# EAGLE schematic ComClone2 (EAGLE 6.3)
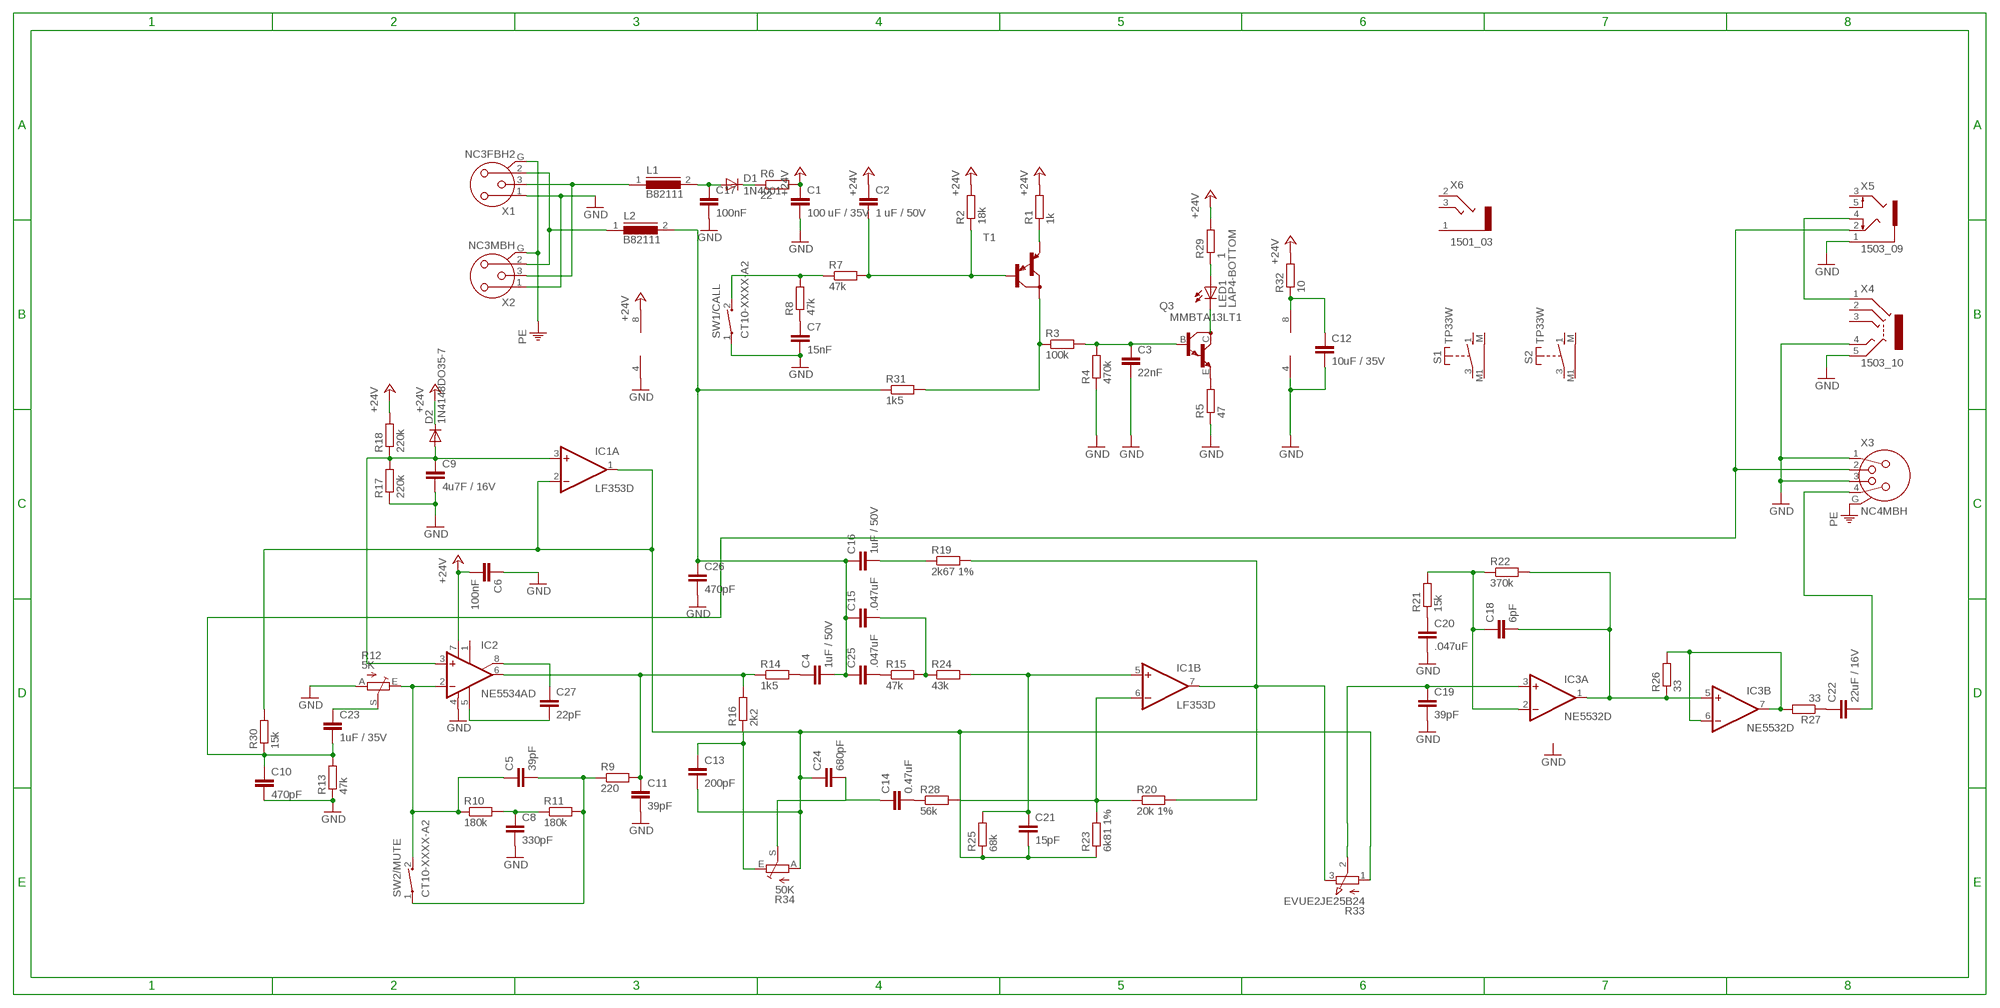
[diagram p0: schematic, sheet 1]

## Parts
C1  100 uF / 35V  C-EUC1206  [C1206]
C2  1 uF / 50V  C-EUC1206  [C1206]
C3  22nF  C-EUC0603  [C0603]
C4  1uF / 50V  C-EUC1206  [C1206]
C5  39pF  C-EUC0603  [C0603]
C6  100nF  C-EUC1206  [C1206]
C7  15nF  C-EUC0603  [C0603]
C8  330pF  C-EUC0603  [C0603]
C9  4u7F / 16V  C-EUC1206  [C1206]
C10  470pF  C-EUC0603  [C0603]
C11  39pF  C-EUC0603  [C0603]
C12  10uF / 35V  C-EUC1206  [C1206]
C13  200pF  C-EUC0603  [C0603]
C14  0.47uF  C-EUC0603  [C0603]
C15  .047uF  C-EUC1206  [C1206]
C16  1uF / 50V  C-EUC3225  [C3225]
C17  100nF  C-EUC1206  [C1206]
C18  6pF  C-EUC1206  [C1206]
C19  39pF  C-EUC1206  [C1206]
C20  .047uF  C-EUC1206  [C1206]
C21  15pF  C-EUC1206  [C1206]
C22  22uF / 16V  C-EUC1206  [C1206]
C23  1uF / 35V  C-EUC1206  [C1206]
C24  680pF  C-EUC0603  [C0603]
C25  .047uF  C-EUC0603  [C0603]
C26  470pF  C-EUC0603  [C0603]
C27  22pF  C-EUC0603  [C0603]
D1  1N4001  1N4004  [DO41-10]
D2  1N4148DO35-7  [DO35-7]
IC1  LF353D  [SO08]
IC2  NE5534AD  [SO08]
IC3  NE5532D  [SO08]
L1  B82111  [SUKW1-30]
L2  B82111  [SUKW1-30]
LED1  LAP4-BOTTOM  [P47F-BOTTOM]
Q3  MMBTA13LT1  [SOT23-BEC]
R1  1k  R-EU_R0603  [R0603]
R2  18k  R-EU_R0603  [R0603]
R3  100k  R-EU_R0603  [R0603]
R4  470k  R-EU_R0603  [R0603]
R5  47  R-EU_M1206  [M1206]
R6  22  R-EU_M1206  [M1206]
R7  47k  R-EU_R0603  [R0603]
R8  47k  R-EU_R0603  [R0603]
R9  220  R-EU_R0603  [R0603]
R10  180k  R-EU_R0603  [R0603]
R11  180k  R-EU_R0603  [R0603]
R12  5K  TRIM_EU-PT10S  [PT-10S]
R13  47k  R-EU_R0603  [R0603]
R14  1k5  R-EU_R0603  [R0603]
R15  47k  R-EU_R0603  [R0603]
R16  2k2  R-EU_R0603  [R0603]
R17  220k  R-EU_M1206  [M1206]
R18  220k  R-EU_M1206  [M1206]
R19  2k67 1%  R-EU_M1206  [M1206]
R20  20k 1%  R-EU_R0603  [R0603]
R21  15k  R-EU_M1206  [M1206]
R22  370k  R-EU_R0603  [R0603]
R23  6k81 1%  R-EU_R0603  [R0603]
R24  43k  R-EU_R0603  [R0603]
R25  68k  R-EU_R0603  [R0603]
R26  33  R-EU_M1206  [M1206]
R27  33  R-EU_M1206  [M1206]
R28  56k  R-EU_R0603  [R0603]
R29  1  R-EU_M1206  [M1206]
R30  15k  R-EU_R0603  [R0603]
R31  1k5  R-EU_R0603  [R0603]
R32  10  R-EU_M1206  [M1206]
R33  EVUE2JE25B24  EVUE2J  [EVUEXXJ]
R34  50K  TRIM_EU-PT10S  [PT-10S]
S1  TP33W  [TP33W]
S2  TP33W  [TP33W]
SW1/CALL  CT10-XXXX-A2  [CT10-XXXX-A2]
SW2/MUTE  CT10-XXXX-A2  [CT10-XXXX-A2]
T1  MMBTA64LT1-PNP_DARL-SOT23-BEC  [SOT23-BEC]
X1  NC3FBH2  [NC3FBH2]
X2  NC3MBH  [NC3MBH]
X3  NC4MBH  [NC4MBH]
X4  1503_10  [1503_10]
X5  1503_09  [1503_09]
X6  1501_03  [1501_03]

## Nets
+24V: C1.1 C2.1 C6.2 D2.C IC1.8(P:V+) IC2.7(V+) R1.2 R2.2 R6.2 R18.2 R29.2 R32.2
GND: C1.2 C3.2 C6.1 C7.2 C8.2 C9.2 C10.2 C11.2 C12.2 C17.2 C19.2 C20.2 C26.2 IC1.4(P:V-) IC2.4(V-) IC3.4(P:V-) R4.1 R5.1 R12.A R13.1 R17.1 SW1/CALL.1 X1.1 X2.1 X3.1 X3.3 X4.4 X4.5 X5.1
N$1: L1.1 X1.3 X2.3
N$2: C3.1 Q3.B R3.2 R4.2
N$3: C12.1 IC3.8(P:V+) R32.1
N$4: C27.1 IC2.8(ON/CMP)
N$5: D1.C R6.1
N$6: C5.1 IC2.2(-IN) R10.1 R12.E SW2/MUTE.2
N$7: C2.2 R2.1 R7.2 T1.B
N$8: C7.1 R8.1
N$9: R7.1 R8.2 SW1/CALL.2
N$10: R1.1 T1.E
N$11: R3.1 R31.2 T1.C
N$12: IC3.6(B:-IN) IC3.7(B:OUT) R26.2 R27.2
N$13: Q3.E R5.2
N$14: LED1.C Q3.C
N$15: LED1.A R29.1
N$16: C9.1 D2.A IC1.3(A:+IN) IC2.3(+IN) R17.2 R18.1
N$17: C14.1 C24.2 R34.S
N$18: C23.1 R12.S
N$19: C10.1 C23.2 R13.2 R30.1 X3.2 X5.2
N$20: C11.1 IC2.6(OUT) R9.2 R14.1 R16.2
N$21: C13.2 C21.2 C24.1 IC1.1(A:OUT) IC1.2(A:-IN) R23.1 R25.1 R30.2 R33.1(A) R34.A
N$22: C8.1 R10.2 R11.1
N$23: C4.1 R14.2
N$24: C5.2 R9.1 R11.2 SW2/MUTE.1
N$25: C13.1 R16.1 R34.E
N$26: C14.2 R28.1
N$27: C17.1 D1.A L1.2
N$28: C25.2 R15.1
N$29: C15.2 R15.2 R24.1
N$30: C16.2 R19.1
N$31: C21.1 IC1.5(B:+IN) R24.2 R25.2
N$32: IC1.7(B:OUT) R19.2 R20.2 R33.3(E)
N$33: IC1.6(B:-IN) R20.1 R23.2 R28.2
N$34: C22.1 R27.1
N$35: C19.1 IC3.3(A:+IN) R33.2(S)
N$36: C18.1 IC3.2(A:-IN) R21.2 R22.1
N$37: C18.2 IC3.1(A:OUT) IC3.5(B:+IN) R22.2 R26.1
N$38: C20.1 R21.1
N$39: L2.1 X1.2 X2.2
N$40: C22.2 X3.4
N$41: X4.1 X5.4
N$42: C4.2 C15.1 C16.1 C25.1 C26.1 L2.2 R31.1
N$43: C27.2 IC2.5(CMP)
PE: X1.G X2.G X3.G
Unconnected: IC2.1(ON) S1.1(S) S1.3(P) S1.M S1.M1(M) S2.1(S) S2.3(P) S2.M S2.M1(M) X4.2 X4.3 X5.3 X5.5 X6.1 X6.2 X6.3

## Library data of the parts
C1-C27 = resistor:C-EU: CAPACITOR, European symbol
D1 = diode:1N4004: DIODE general purpose rectifier, 1 A
D2 = diode:1N4148: DIODE high speed (Philips)
IC1 = linear:LF353: OP AMP
IC2 = linear:NE5534: LOW-NOISE OPERATIONAL AMPLIFIER Source: http://focus.ti.com/lit/ds/symlink/ne5534.pdf
IC3 = linear:NE5532: AUDIO AMPLIFIER
L1 L2 = inductors:B82111: INDUCTOR
LED1 = led:*P4: PointLED® Enhanced Thinfilm LED TOP & BOTTOM mount LS P47F, LR P47F, LA P47F, LY P47F, LT P4SG, LB P4SG, LW P4SG Source: http://catalog.osram-os.com .. LA_LR_LS_LY_P47F_Pb_free.pdf
Q3 = transistor-npn:MMBTA13*: NPN Darlington Transistor
R1-R11 R13-R32 = resistor:R-EU_: RESISTOR, European symbol
R12 R34 = pot:TRIM_EU-: POTENTIOMETER
R33 = pot:EVU: 9 mm Square Rotary Potentiometers Source: Panasonic
S1 S2 = switch-misc:TP33W: SWITCH
SW1/CALL SW2/MUTE = switch-coto:CT10-XXXX-: CT10 Series Molded Switch Source: www.cotorelay.com .. Coto_Technology__CT10-1530-G1.pdf
T1 = transistor-neu-to92:*-PNP_DARL-: PNP Darlington Transistor
X1 = con-neutrik_ag:NC3: Neutrik Audio Connector XLR SERIES Stereo 1/4" jack Source: www.neutrik.com/; MPN: NC3FBH2; OC_FARNELL: unknown; OC_NEWARK: 27B4226
X2 = con-neutrik_ag:NC3: Neutrik Audio Connector XLR SERIES Stereo 1/4" jack Source: www.neutrik.com/; MF: NEUTRIK; MPN: NC3MBH; OC_FARNELL: unknown; OC_NEWARK: 91F3470
X3 = con-neutrik_ag:NC4: Neutrik Audio Connector XLR SERIES Stereo 1/4" jack Source: www.neutrik.com/; OC_FARNELL: unknown; OC_NEWARK: unknown
X4 = con-lumberg:1503_10: Jack connectors according to JISC 6560, 3.5 mm Klinkeneinbaukupplung, 3,5 mm, 4-polig/stereo, abgewinkelte Ausführung Source: http://www.lumberg.de/Produkte/PDFs/1503_10.pdf; OC_FARNELL: 1308868; OC_NEWARK: unknown
X5 = con-lumberg:1503_09: Jack connectors according to JISC 6560, 3.5 mm Klinkeneinbaukupplung nach JISC 6560, 3,5 mm, 3-polig/ stereo, abgewinkelte Ausführung, mit 2 Öffnern und Lötaugen, für Leiterplatten Rückseitenmontage Source: http://www.lumberg.com/Produkte/PDFs/1503_09.pdf; OC_FARNELL: 1243244; OC_NEWARK: unknown
X6 = con-lumberg:1501_03: Klinkensteckverbinder nach JISC 6560, 2,5 mm Jack connectors according to JISC 6560, 2.5 mm Source: http://www.lumberg.com/Produkte/PDFs/1501_03.pdf; OC_FARNELL: 1200127; OC_NEWARK: unknown